# EAGLE schematic main (EAGLE 9.0.1)
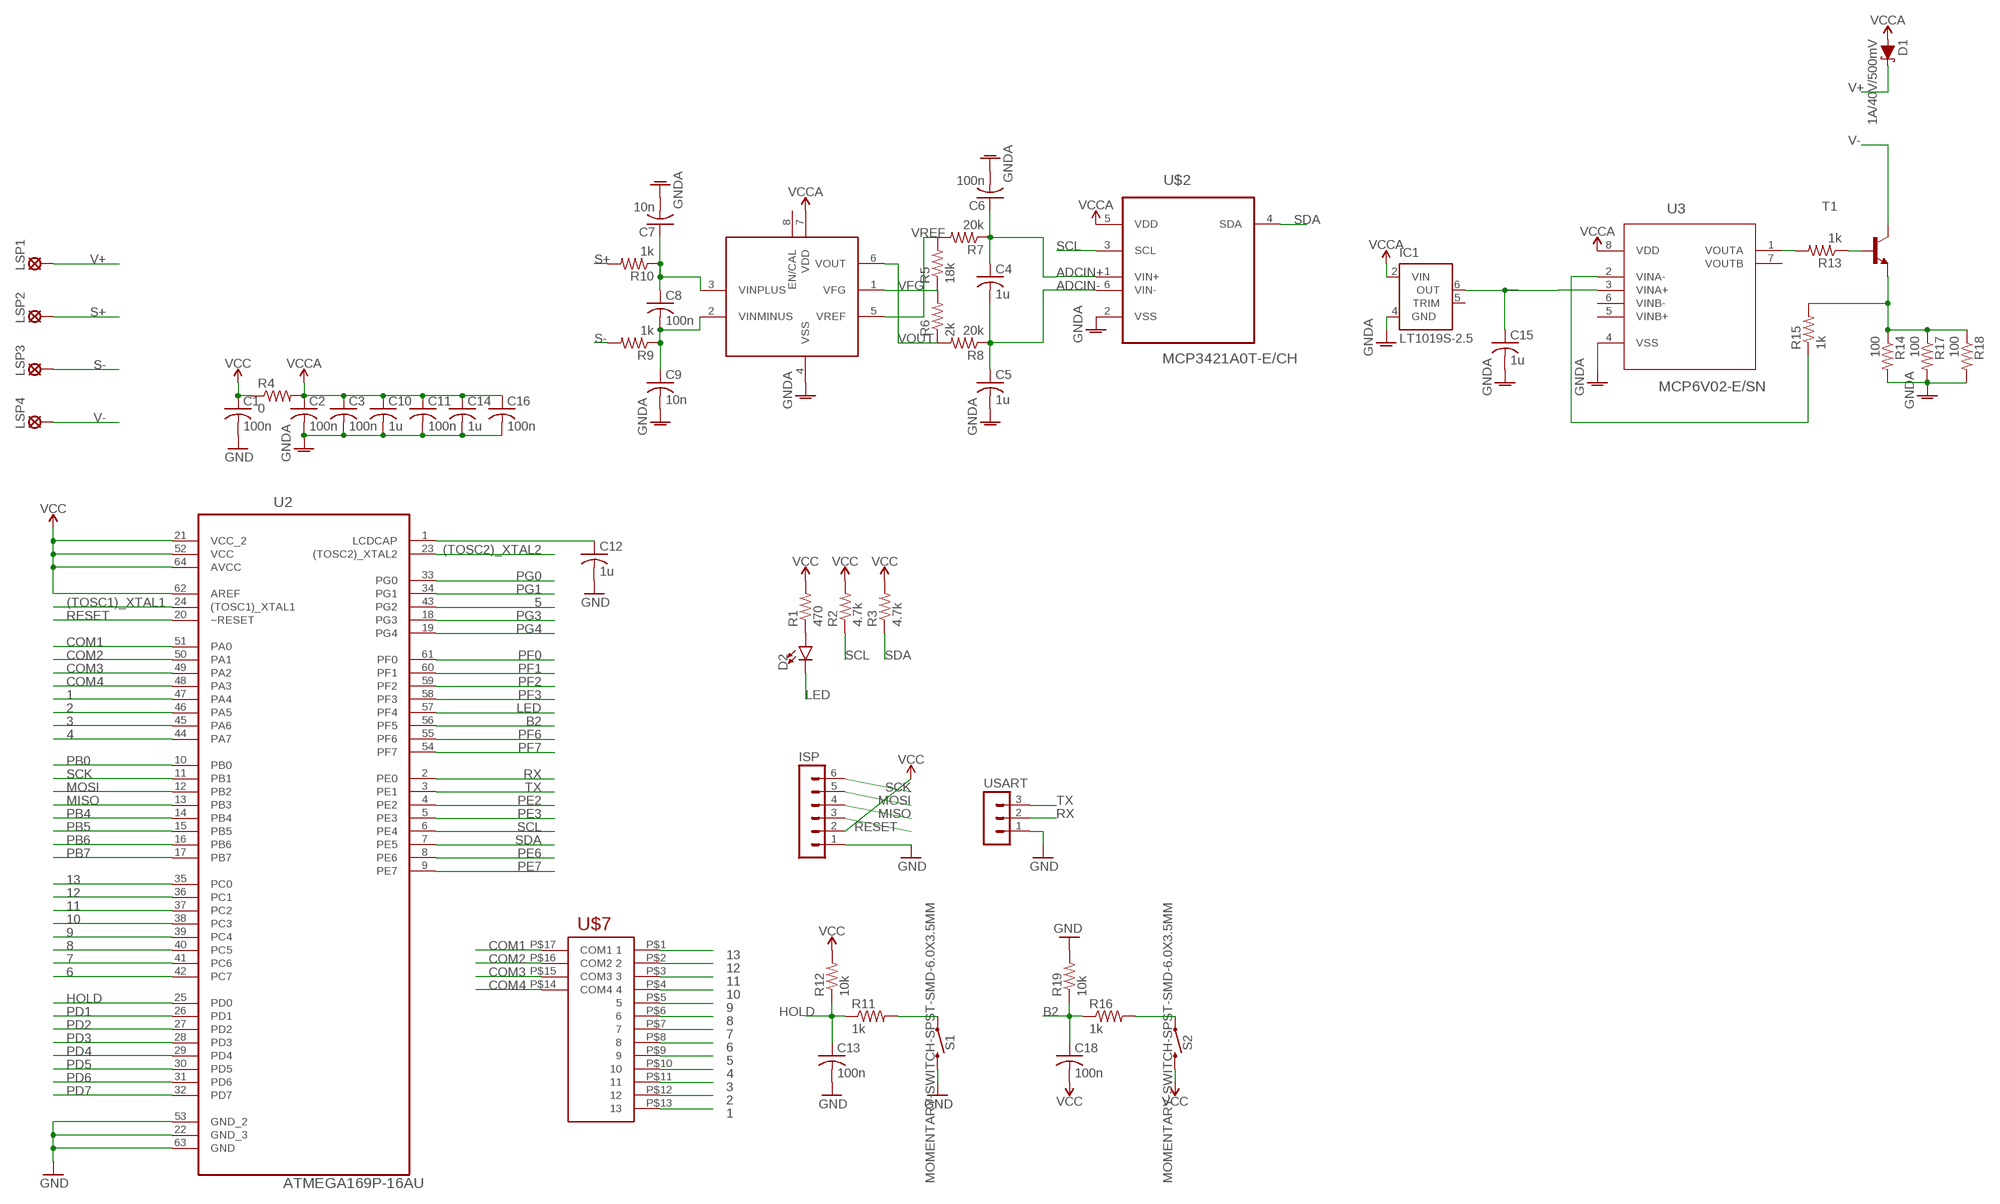
[diagram p0: schematic, sheet 1]

## Parts
C1  100n  C-USC0603  [C0603]
C2  100n  C-USC0603  [C0603]
C3  100n  C-USC0603  [C0603]
C4  1u  C-USC0603  [C0603]
C5  1u  C-USC0603  [C0603]
C6  100n  C-USC0603  [C0603]
C7  10n  C-USC0603  [C0603]
C8  100n  C-USC0603  [C0603]
C9  10n  C-USC0603  [C0603]
C10  1u  C-USC0603  [C0603]
C11  100n  C-USC0603  [C0603]
C12  1u  C-USC0603  [C0603]
C13  100n  C-USC0603  [C0603]
C14  1u  C-USC0603  [C0603]
C15  1u  C-USC0603  [C0603]
C16  100n  C-USC0603  [C0603]
C18  100n  C-USC0603  [C0603]
D1  1A/40V/500mV  DIODE-SCHOTTKY-SS14  [SMA-DIODE]
D2  LED5MM  [LED_5MM]
IC1  LT1019S-2.5  [SOIC8]
ISP  MA06-1  [MA06-1]
LSP1  MCS08  [MCS08]
LSP2  MCS08  [MCS08]
LSP3  MCS08  [MCS08]
LSP4  MCS08  [MCS08]
R1  470  R-US_R0603  [R0603]
R2  4.7k  R-US_R0603  [R0603]
R3  4.7k  R-US_R0603  [R0603]
R4  0  R-US_0309/12  [0309/12]
R5  18k  R-US_R0603  [R0603]
R6  2k  R-US_R0603  [R0603]
R7  20k  R-US_R0603  [R0603]
R8  20k  R-US_R0603  [R0603]
R9  1k  R-US_R0603  [R0603]
R10  1k  R-US_R0603  [R0603]
R11  1k  R-US_R0603  [R0603]
R12  10k  R-US_R0603  [R0603]
R13  1k  R-US_R0603  [R0603]
R14  100  R-US_R0603  [R0603]
R15  1k  R-US_R0603  [R0603]
R16  1k  R-US_R0603  [R0603]
R17  100  R-US_R0603  [R0603]
R18  100  R-US_R0603  [R0603]
R19  10k  R-US_R0603  [R0603]
S1  MOMENTARY-SWITCH-SPST-SMD-6.0X3.5MM  [TACTILE_SWITCH_SMD_6.0X3.5MM]
S2  MOMENTARY-SWITCH-SPST-SMD-6.0X3.5MM  [TACTILE_SWITCH_SMD_6.0X3.5MM]
T1  MMBT3904LT1-NPN-SOT23-BEC  [SOT23-BEC]
U2  ATMEGA169P-16AU  [QFP80P1600X1600X120-64N]
U3  MCP6V02-E/SN  [SOIC127P600X175-8N]
U$2  MCP3421A0T-E/CH  [SOT95P270X145-6N]
U$3  MCP6N11  [SOIC8]
U$7  GDC0570_LCD  [GDC0570_LCD]
USART  MA03-1  [MA03-1]

## Nets
1: U2.47(PA4) U$7.P$13
2: U2.46(PA5) U$7.P$12
3: U2.45(PA6) U$7.P$11
4: U2.44(PA7) U$7.P$10
5: U2.43(PG2) U$7.P$9
6: U2.42(PC7) U$7.P$8
7: U2.41(PC6) U$7.P$7
8: U2.40(PC5) U$7.P$6
9: U2.39(PC4) U$7.P$5
10: U2.38(PC3) U$7.P$4
11: U2.37(PC2) U$7.P$3
12: U2.36(PC1) U$7.P$2
13: U2.35(PC0) U$7.P$1
(TOSC1)_XTAL1: U2.24((TOSC1)_XTAL1)
(TOSC2)_XTAL2: U2.23((TOSC2)_XTAL2)
ADCIN+: C4.1 C6.1 R7.1 U$2.1(VIN+)
ADCIN-: C4.2 C5.1 R8.1 U$2.6(VIN-)
B2: C18.1 R16.1 R19.1 U2.56(PF5)
COM1: U2.51(PA0) U$7.P$17(COM1)
COM2: U2.50(PA1) U$7.P$16(COM2)
COM3: U2.49(PA2) U$7.P$15(COM3)
COM4: U2.48(PA3) U$7.P$14(COM4)
GND: C1.2 C12.2 C13.2 ISP.1 R19.2 S1.2 U2.22(GND_3) U2.53(GND_2) U2.63(GND) USART.1
GNDA: C2.2 C3.2 C5.2 C6.2 C7.2 C9.2 C10.2 C11.2 C14.2 C15.2 C16.2 IC1.4(GND) R14.2 R17.2 R18.2 U3.4(VSS) U$2.2(VSS) U$3.4(VSS)
HOLD: C13.1 R11.1 R12.1 U2.25(PD0)
LCDCAP: C12.1 U2.1(LCDCAP)
LED: D2.K(C) U2.57(PF4)
MISO: ISP.4 U2.13(PB3)
MOSI: ISP.5 U2.12(PB2)
N1: R11.2 S1.1
N2: R16.2 S2.1
N$2: C15.1 IC1.6(OUT) U3.3(VINA+)
N$3: R14.1 R15.2 R17.1 R18.1 T1.E
N$4: C8.2 C9.1 R9.1 U$3.2(VINMINUS)
N$5: C7.1 C8.1 R10.1 U$3.3(VINPLUS)
N$6: D2.A R1.1
N$7: R13.2 U3.1(VOUTA)
N$8: R13.1 T1.B
N$9: R15.1 U3.2(VINA-)
PB0: U2.10(PB0)
PB4: U2.14(PB4)
PB5: U2.15(PB5)
PB6: U2.16(PB6)
PB7: U2.17(PB7)
PD1: U2.26(PD1)
PD2: U2.27(PD2)
PD3: U2.28(PD3)
PD4: U2.29(PD4)
PD5: U2.30(PD5)
PD6: U2.31(PD6)
PD7: U2.32(PD7)
PE2: U2.4(PE2)
PE3: U2.5(PE3)
PE6: U2.8(PE6)
PE7: U2.9(PE7)
PF0: U2.61(PF0)
PF1: U2.60(PF1)
PF2: U2.59(PF2)
PF3: U2.58(PF3)
PF6: U2.55(PF6)
PF7: U2.54(PF7)
PG0: U2.33(PG0)
PG1: U2.34(PG1)
PG3: U2.18(PG3)
PG4: U2.19(PG4)
RESET: ISP.3 U2.20(~RESET)
RX: U2.2(PE0) USART.2
S+: LSP2.MP R10.2
S-: LSP3.MP R9.2
SCK: ISP.6 U2.11(PB1)
SCL: R2.1 U2.6(PE4) U$2.3(SCL)
SDA: R3.1 U2.7(PE5) U$2.4(SDA)
TX: U2.3(PE1) USART.3
V+: D1.C LSP1.MP
V-: LSP4.MP T1.C
VCC: C1.1 C18.2 ISP.2 R1.2 R2.2 R3.2 R4.1 R12.2 S2.2 U2.21(VCC_2) U2.52(VCC) U2.62(AREF) U2.64(AVCC)
VCCA: C2.1 C3.1 C10.1 C11.1 C14.1 C16.1 D1.A IC1.2(VIN) R4.2 U3.8(VDD) U$2.5(VDD) U$3.7(VDD)
VFG: R5.1 R6.2 U$3.1(VFG)
VOUT: R6.1 R8.2 U$3.6(VOUT)
VREF: R5.2 R7.2 U$3.5(VREF)
Unconnected: IC1.5(TRIM) U3.5(VINB+) U3.6(VINB-) U3.7(VOUTB) U$3.8(EN/CAL)

## Library data of the parts
C1-C16 C18 = rcl:C-US: CAPACITOR, American symbol; SPICEPREFIX: C
D1 = SparkFun-DiscreteSemi:DIODE-SCHOTTKY: Schottky diode A Schottky diode is a semiconductor diode which has a low forward voltage drop and a very fast switching action.; PROD_ID: DIO-08053
D2 = SparkFun-LED:LED: LED (Generic) Standard schematic elements and footprints for 5mm, 3mm, 1206, and 0603 sized LEDs. Generic LEDs with no color specified.
IC1 = linear-technology:LT1019?*: Precision Voltage Reference Source: http://www.linear.com/pc/downloadDocument.do?navId=H0,C1,C1154,C1002,C1243,P1130,D3834; MPN: LT1019CS8-2.5#PBF; OC_FARNELL: 9559426; OC_NEWARK: 57M0929
ISP = con-lstb:MA06-1: PIN HEADER; OC_FARNELL: unknown; OC_NEWARK: unknown
LSP1-LSP4 = solpad:MCS08: SOLDER PAD MC S0,8, drill 1.2 mm, distributor Buerklin, 08F130
R1-R19 = rcl:R-US_: RESISTOR, American symbol; SPICEPREFIX: R
S1 S2 = SparkFun-Switches:MOMENTARY-SWITCH-SPST: Momentary Switch (Pushbutton) - SPST Normally-open (NO) SPST momentary switches (buttons, pushbuttons). Variants PTH-12MM - 12mm square, through-hole Momentary Pushbutton Switch - 12mm Square <https://www.sparkfun.com/products/9190> (COM-09190) PTH-6.0MM, PTH-6.0MM-KIT - 6.0mm square, through-hole Mini Pushbutton Switch <https://www.sparkfun.com/products/97> (COM-00097) KIT package intended for soldering kit's - only one side of pads' copper is exposed. PTH-RIGHT-ANGLE-KIT - Right-angle, through-hole Right Angle Tactile Button <https://www.sparkfun.com/products/10791> - Used on SparkFun BigTime Watch Kit <https://www.sparkfun.com/products/11734> SMD-12MM - 12mm square, surface-mount Tactile Button - SMD (12mm) <https://www.sparkfun.com/products/12993> (COM-12993) Used on SparkFun PicoBoard <https://www.sparkfun.com/products/11888> SMD-4.5MM - 4.5mm Square Trackball Switch Used on SparkFun Blackberry Trackballer Breakout <https://www.sparkfun.com/products/13169> SMD-4.6MMX2.8MM - 4.60mm x 2.80mm, surface mount Used on SparkFun SAMD21 Mini Breakout <https://www.sparkfun.com/products/13664> SMD-5.2MM, SMD-5.2-REDUNDANT - 5.2mm square, surface-mount Mini Pushbutton Switch - SMD <https://www.sparkfun.com/products/8720> (COM-08720) Used on Arduino Pro Mini <https://www.sparkfun.com/products/11114> REDUNDANT package connects both switch circuits together SMD-6.0X3.5MM - 6.0 x 3.5mm, surface mount Momentary Reset Switch SMD <https://www.sparkfun.com/products/8229> (COM-08229) SMD-6.2MM-TALL - 6.2mm square, surface mount Tactile Button - SMD (6mm) <https://www.sparkfun.com/products/12992> Used on SparkFun Digital Sandbox <https://www.sparkfun.com/products/12651> SMD-RIGHT-ANGLE - Right-angle, surface mount Used on SparkFun Block for Intel® Edison - Arduino <https://www.sparkfun.com/products/13036>; PROD_ID: SWCH-00815; SF_SKU: COM-08229
T1 = DC_LOAD_AU:*-NPN-: NPN Transistror BF959 corrected 2008.03.06
U2 = 7_segment_lib:ATMEGA169P-16AU: 8-bit Microcontroller with 16K Bytes In-System Programmable Flash; MPN: ATMEGA169P-16AU; OC_FARNELL: 1675975; OC_NEWARK: 33P6478; PACKAGE: TQFP-64; SUPPLIER: Atmel
U3 = Microchip_By_element14_Batch_1:MCP6V02-E/SN: Auto-Zeroed Op Amps; MPN: MCP6V02-E/SN; OC_FARNELL: 1629346; OC_NEWARK: 27M0220; PACKAGE: SOIC-8; SUPPLIER: Microchip
U$2 = Microchip_By_element14_Batch_1:MCP3421A0T-E/CH: Analog-to-Digital Converter; MPN: MCP3421A0T-E/CH; OC_FARNELL: 1605567; OC_NEWARK: 77M2561; PACKAGE: SOT-6; SUPPLIER: Microchip
U$3 = 7_segment_lib:MCP6N11
U$7 = 7_segment_lib:GDC0570_LCD
USART = con-lstb:MA03-1: PIN HEADER; OC_FARNELL: unknown; OC_NEWARK: unknown